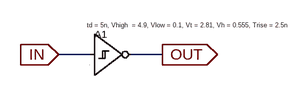
[diagram p0: schematic SN74LVC1G14DBVR.asc]
SN74LVC1G14DBVR.asc, the LTspice schematic file:
Version 4.1
SHEET 1 880 680
WIRE 112 112 64 112
WIRE 224 112 176 112
FLAG 64 112 IN
IOPIN 64 112 In
FLAG 224 112 OUT
IOPIN 224 112 Out
SYMBOL Digital\\schmtinv 112 48 R0
WINDOW 0 8 32 Left 1
WINDOW 3 -4 18 Left 0
SYMATTR InstName A1
SYMATTR Value td = 5n, Vhigh  = 4.9, Vlow = 0.1, Vt = 2.81, Vh = 0.555, Trise = 2.5n

The netlist it stands for:
* SN74LVC1G14DBVR.asc
A1 IN 0 0 0 0 OUT 0 0 SCHMITT td = 5n, Vhigh  = 4.9, Vlow = 0.1, Vt = 2.81, Vh = 0.555, Trise = 2.5n
.backanno
.end